# Altium schematic sheet micro.SchDoc
size A4
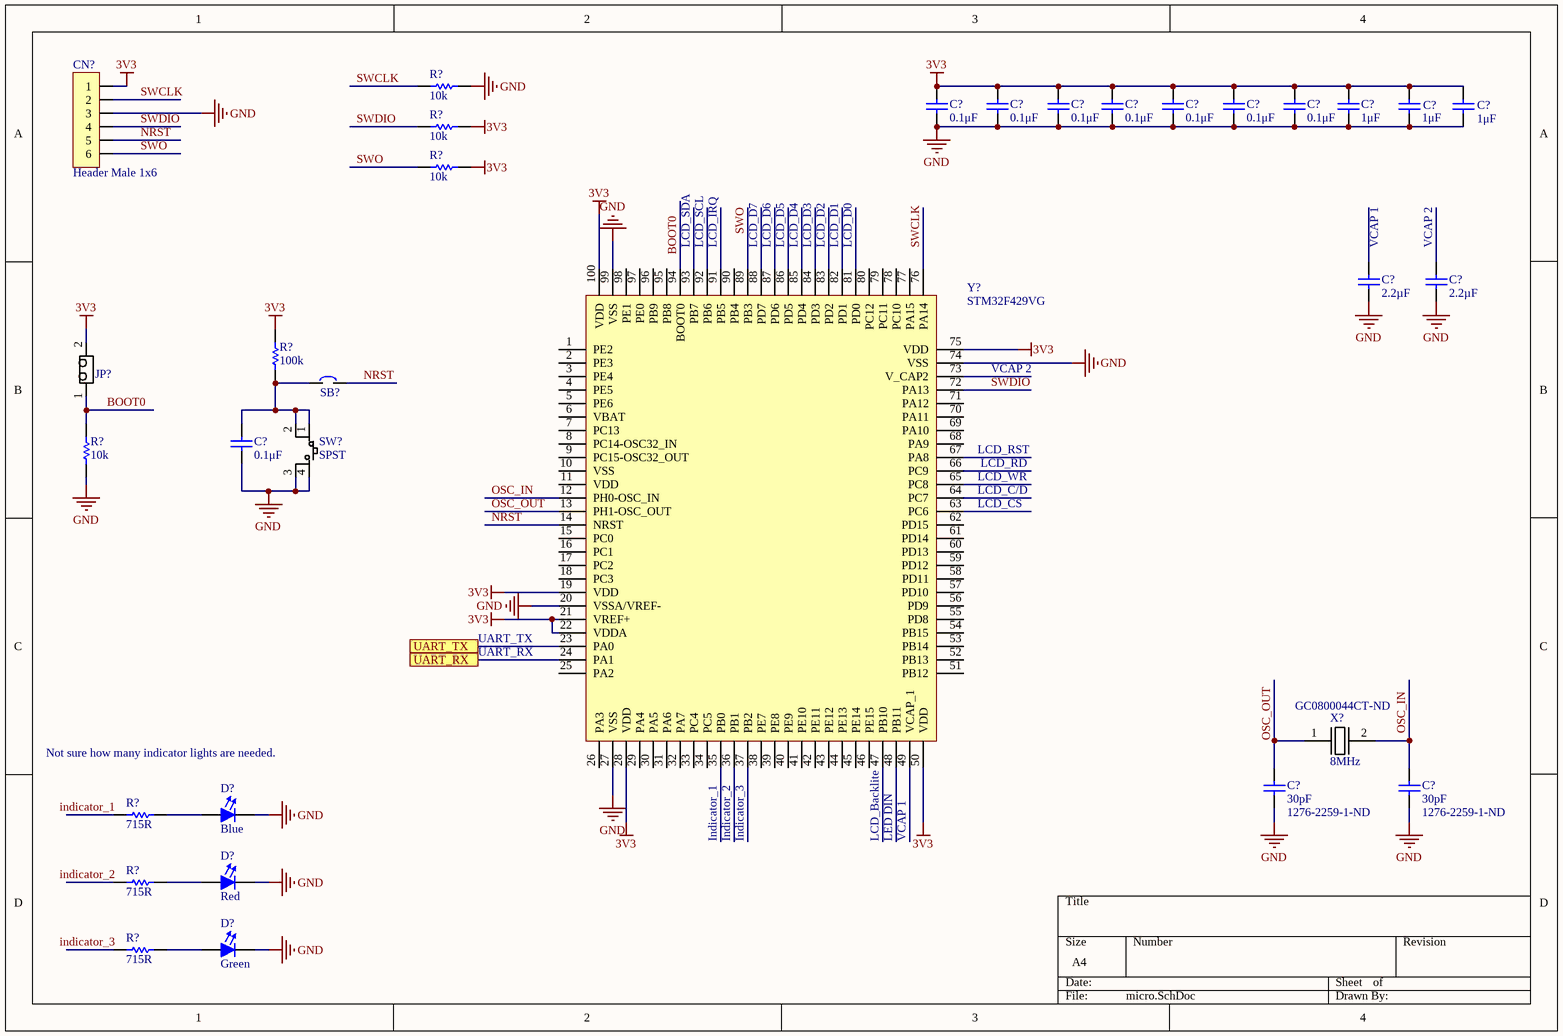
[diagram p0: micro.SchDoc]

## Parts
(Parts that share a designator on the sheet are numbered #1, #2 ... from top to bottom, then left to right.)
C?#1  0.1μF  [CAPC1608N(0603")]
C?#2  0.1μF  [CAPC1608N(0603")]
C?#3  0.1μF  [CAPC1608N(0603")]
C?#4  0.1μF  [CAPC1608N(0603")]
C?#5  0.1μF  [CAPC1608N(0603")]
C?#6  0.1μF  [CAPC1608N(0603")]
C?#7  0.1μF  [CAPC1608N(0603")]
C?#8  1μF  [CAPC1608N(0603")]
C?#9  1μF  [CAPC1608N(0603")]
C?#10  1μF  [CAPC1608N(0603")]
C?#11  2.2µF  [CAPC1608N(0603")]
C?#12  2.2µF  [CAPC1608N(0603")]
C?#13  0.1μF  [CAPC1608N(0603")]
C?#14  30pF  Supplier Part Number 1: 1276-2259-1-ND  [CAPC1608N(0603")]
C?#15  30pF  Supplier Part Number 1: 1276-2259-1-ND  [CAPC1608N(0603")]
CN?  Header Male 1x6  [Header, Male, 1X6]
D?#1  Blue  [LED0805]
D?#2  Red  [LED0805]
D?#3  Green  [LED0805]
JP?  1X2 Pin Head  [2X1 Males Header]  (value not drawn)
R?#1  10k  [RESC1608N(0603")]
R?#2  10k  [RESC1608N(0603")]
R?#3  10k  [RESC1608N(0603")]
R?#4  100k  [RESC1608N(0603")]
R?#5  10k  [RESC1608N(0603")]
R?#6  715R  [RESC1608N(0603")]
R?#7  715R  [RESC1608N(0603")]
R?#8  715R  [RESC1608N(0603")]
SB?  Solder Bridge  [Solder Bridge]  (value not drawn)
SW?  SPST  [4-SPST-NO]
X?  8MHz  Supplier Part Number 1: GC0800044CT-ND  [HC49/US]
Y?  STM32F429VG  [STM-LQFP100_M]

## Ports
UART_RX, UART_TX

## Nets
3V3: C?#1.2(Cathode) C?#2.2(Cathode) C?#3.2(Cathode) C?#4.2(Cathode) C?#5.2(Cathode) C?#6.2(Cathode) C?#7.2(Cathode) C?#8.2(Cathode) C?#9.2(Cathode) C?#10.2(Cathode) CN?.1 JP?.2 R?#2.2 R?#3.2 R?#4.2 Y?.19(VDD) Y?.21(VREF+) Y?.22(VDDA) Y?.28(VDD) Y?.50(VDD) Y?.75(VDD) Y?.100(VDD)
GND: C?#1.1(Anode) C?#2.1(Anode) C?#3.1(Anode) C?#4.1(Anode) C?#5.1(Anode) C?#6.1(Anode) C?#7.1(Anode) C?#8.1(Anode) C?#9.1(Anode) C?#10.1(Anode) C?#11.1(Anode) C?#12.1(Anode) C?#13.1(Anode) C?#14.1 C?#15.1 CN?.3 D?#1.1(Cathode) D?#2.1(Cathode) D?#3.1(Cathode) R?#1.1 R?#5.1 SW?.3 SW?.4 Y?.20(VSSA/VREF-) Y?.27(VSS) Y?.74(VSS) Y?.99(VSS)
BOOT0: JP?.1 R?#5.2 Y?.94(BOOT0)
NRST: CN?.5 SB?.2 Y?.14(NRST)
OSC_IN: C?#15.2 X?.2 Y?.12(PH0-OSC_IN)
OSC_OUT: C?#14.2 X?.1 Y?.13(PH1-OSC_OUT)
SWCLK: CN?.2 R?#1.2 Y?.76(PA14)
SWDIO: CN?.4 R?#2.1 Y?.72(PA13)
SWO: CN?.6 R?#3.1 Y?.89(PB3)
UART_RX: Y?.24(PA1) ; port UART_RX
UART_TX: Y?.23(PA0) ; port UART_TX
NetC?#13_2: C?#13.2(Cathode) R?#4.1 SB?.1 SW?.1 SW?.2
NetD?#1_2: D?#1.2(Anode) R?#6.1
NetD?#2_2: D?#2.2(Anode) R?#7.1
NetD?#3_2: D?#3.2(Anode) R?#8.1

Not connected (* = marked no-connect by the designer): C?#11 2(Cathode); C?#12 2(Cathode); R?#6 2; R?#7 2; R?#8 2; Y? 1(PE2) 2(PE3) 3(PE4) 4(PE5) 5(PE6) 6(VBAT) 7(PC13) 8(PC14-OSC32_IN) 9(PC15-OSC32_OUT) 10(VSS) 11(VDD) 15(PC0) 16(PC1) 17(PC2) 18(PC3) 25(PA2) 26(PA3) 29(PA4) 30(PA5) 31(PA6) 32(PA7) 33(PC4) 34(PC5) 35(PB0) 36(PB1) 37(PB2) 38(PE7) 39(PE8) 40(PE9) 41(PE10) 42(PE11) 43(PE12) 44(PE13) 45(PE14) 46(PE15) 47(PB10) 48(PB11) 49(VCAP_1) 51(PB12) 52(PB13) 53(PB14) 54(PB15) 55(PD8) 56(PD9) 57(PD10) 58(PD11) 59(PD12) 60(PD13) 61(PD14) 62(PD15) 63(PC6) 64(PC7) 65(PC8) 66(PC9) 67(PA8) 68(PA9) 69(PA10) 70(PA11) 71(PA12) 73(V_CAP2) 77(PA15) 78(PC10) 79(PC11) 80(PC12) 81(PD0) 82(PD1) 83(PD2) 84(PD3) 85(PD4) 86(PD5) 87(PD6) 88(PD7) 90(PB4) 91(PB5) 92(PB6) 93(PB7) 95(PB8) 96(PB9) 97(PE0) 98(PE1)

## Notes on the sheet
- (near Y?) LCD_SDA
- (near Y?) LCD_SCL
- (near Y?) LCD_IRQ
- (near Y?) LCD_D7
- (near Y?) LCD_D6
- (near Y?) LCD_D5
- (near Y?) LCD_D4
- (near Y?) LCD_D3
- (near Y?) LCD_D2
- (near Y?) LCD_D1
- (near Y?) LCD_D0
- (near C?#11) VCAP 1
- (near C?#12) VCAP 2
- VCAP 2
- (near Y?) LCD_RST
- (near Y?) LCD_WR
- (near Y?) LCD_C/D
- (near Y?) LCD_CS
- (near Y?) LCD_RD
- UART_TX
- UART_RX
- Not sure how many indicator lights are needed.
- (near Y?) Indicator_1
- (near Y?) Indicator_2
- (near Y?) Indicator_3
- (near Y?) LCD_Backlite
- LED DIN
- VCAP 1
- Labels drawn without touching a wire or pin: indicator_1, indicator_2, indicator_3

## Library data of the parts
C?#1-C?#7 C?#13 = 0.1uF 100V 0603 SMD, Ceramic: Capacitor, Ceramic, 100V, +/- 10%, 0603 SMD, X7R; MFG: TDK; MFG#: CGA3E3X7S2A104K080AB; Published: 16-04-26; Publisher: AUVic; PackageDescription: Chip Capacitor; Value: 0.1μF; Created By: Ashwin Sira; Supplier 1: Digi-Key; Supplier Part Number 1: 445-6938-1-ND
C?#8-C?#10 = 1uF 25V 0603 SMD, Ceramic: Capacitor, Ceramic, 25V, +/- 10%, 0603 SMD, X5R; MFG: Murata-Electronics-North-America; MFG#: GRM188R61E105KA12D; Published: 16-06-27; Publisher: AUVic; PackageDescription: Chip Capacitor; Value: 1μF; Created By: Andy Bates; Supplier 1: Digi-Key; Supplier Part Number 1: 490-3897-1-ND
C?#11 C?#12 = 2.2uF, 50V, 0603 SMD, X5R, Ceramic: Capacitor, Ceramic, 50V, 10%, 0603 SMD, X5R; Date Created: *; PackageDescription: Chip Capacitor; Value: 2.2µF; Made By: *; Publisher: AUVic; Supplier 1: Digi-Key; Supplier Part Number 1: 490-10733-1-ND
C?#14 C?#15 = 30pF 50V 0603 SMD, Ceramic: Capacitor, Ceramic, 50V, +/-1%, 0603 SMD, C0G; Made By: Andy Bates; Published: 16-09-12; Publisher: AUVic; PackageDescription: Chip Capacitor; Value: 30pF; Supplier 1: Digi-Key
CN? = Header, Male, 1x6: 1x6, Pads Pitch: 0.1" (2.54mm), Through hole; Made Bates: Andy Bates; Supplier 1: Digikey; Supplier 1 Part Number: 952-2270-ND
D?#1 D?#3 = LED, 0805 (2012), Blue, Clear: Colour: Red; Created By: Ashwin Sira; Supplier 1: Digi-Key; Supplier Part Number 1: 732-4982-1-ND
D?#2 = LED, 0805 (2012), Blue, Clear: Colour: Red; Created By: Ashwin Sira; Supplier 1: Digi-Key; Supplier Part Number 1: 732-4982-1-ND
JP? = 1x2 Male Header: Made By: Andy Bates; Supplier 1: Digi-Key; Supplier Part Number 1: 952-3073-ND
R?#1-R?#3 R?#5 = 10kR, 1%, 1/10W, 0603 SMD: Made By: Ashwin Sira; Owned By: AUVic; Created On: 14-05-31; Last Edited: 14-05-31; Supplier 1: Digi-Key; Supplier Part Number 1: 311-10.0KHRCT-ND; Value: 10k
R?#4 = 100kR, 1%, 1/10W, 0603 SMD: Made By: Andy Bates; Owned By: AUVic; Created On: 14-06-30; Last Edited: 14-06-30; Value: 100k; Supplier 1: Digi-Key; Supplier Part Number 1: 311-100KGRCT-ND
R?#6-R?#8 = 715R, 1%, 1/10W, 0603, SMD: Created By: Ashwin Sira; Publisher: AUVic; Date Created: 2016-06-10; Value: 715R; Supplier 1: Digi-Key; Supplier Part Number 1: 541-715HCT-ND
SB? = Solder Bridge: Made By: Andy Bates; Created On: 2016/09/08
SW? = 4 pin Tacitle Switch: Made By: Andy Bates; Button Type: Single Pole Single Throw; Supplier 1: Digikey; Supplier 1 Part Number: CKN9084CT-ND
X? = Oscillator 8MHz 40ESR: 8Mhz 40ESR  16pF -20°C ~ 70°C; Made By: Lyden Smith; Date Made: 2017-09-18; Supplier 1: Digi-Key
Y? = STM32F413VGT6: ARM Cortex-M4 32-bit MCU, 180 MHz, 320 KB Internal Rap, 81 I/O, 100-pin LQFP, -40 to 85 degC, Tray; Core Size: 32-bit; Supplier 1: Digi-Key